# EAGLE schematic InterfazSpectrum (EAGLE 7.1.0)
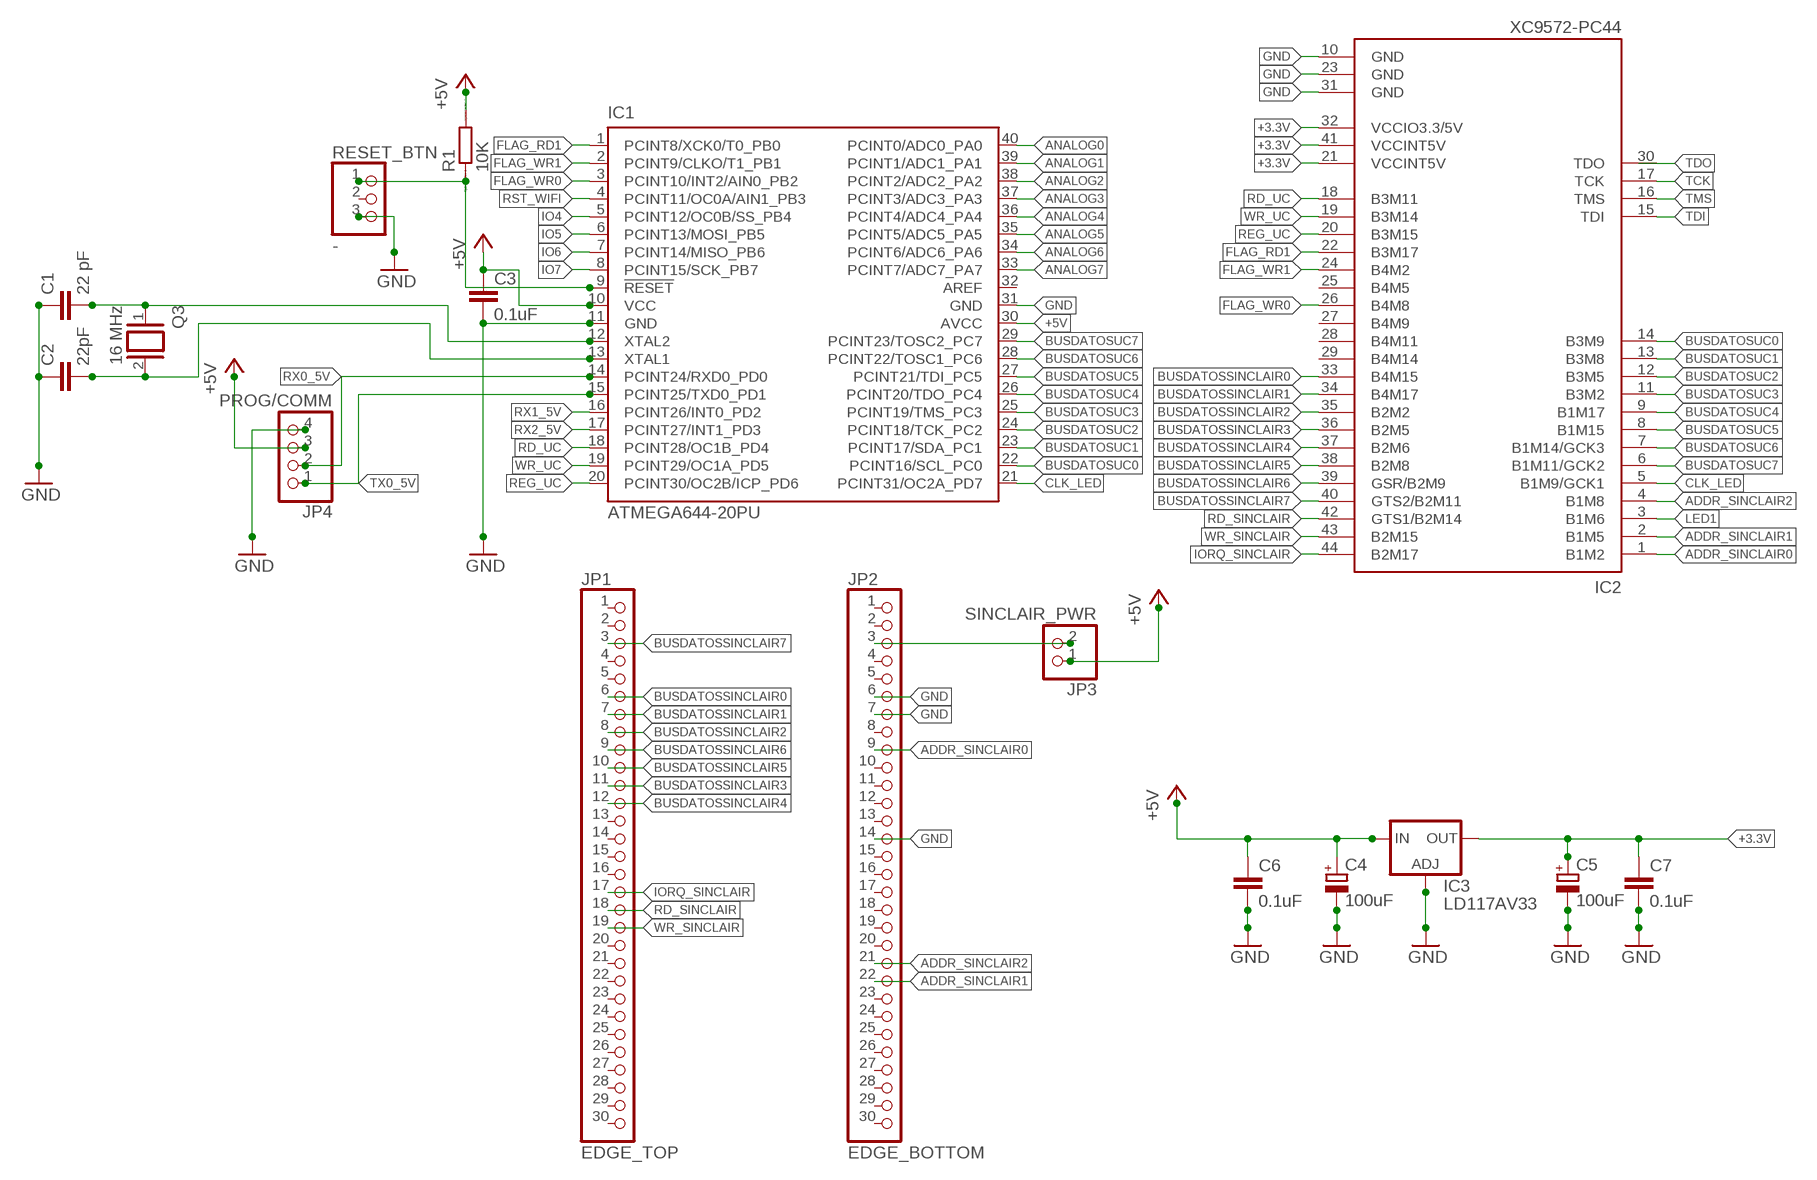
[diagram p0: schematic, sheet 1]

## Parts
C1  22 pF  C-EU025-024X044  [C025-024X044]
C2  22pF  C-EU025-024X044  [C025-024X044]
C3  0.1uF  C-EU025-025X050  [C025-025X050]
C4  100uF  CPOL-EUE2.5-7  [E2,5-7]
C5  100uF  CPOL-EUE2.5-7  [E2,5-7]
C6  0.1uF  C-EU025-025X050  [C025-025X050]
C7  0.1uF  C-EU025-025X050  [C025-025X050]
IC1  ATMEGA644-20PU  [DIL40]
IC2  XC9572-PC44  [PLCC-S44]
IC3  LD117AV33  [TO220L1]
JP1  EDGE_TOP  PINHD-1X30  [1X30]
JP2  EDGE_BOTTOM  PINHD-1X30  [1X30]
JP3  SINCLAIR_PWR  PINHD-1X2  [1X02]
JP4  PROG/COMM  PINHD-1X4  [1X04]
Q3  16 MHz  XTAL/S  [QS]
R1  10K  R-EU_0204_2V  [0204V]
RESET_BTN  -  PINHD-1X3  [1X03]

## Nets
+3.3V: C5.+ C7.1 IC2.21(VCCINT5V) IC2.32(VCCIO3.3/5V) IC2.41(VCCINT5V) IC3.2(OUT)
+5V: C3.1 C4.+ C6.1 IC1.10(VCC) IC1.30(AVCC) IC3.3(IN) JP3.1 JP4.3 R1.2
ADDR_SINCLAIR0: IC2.1(B1M2) JP2.9
ADDR_SINCLAIR1: IC2.2(B1M5) JP2.22
ADDR_SINCLAIR2: IC2.4(B1M8) JP2.21
ANALOG0: IC1.40(PCINT0/ADC0_PA0)
ANALOG1: IC1.39(PCINT1/ADC1_PA1)
ANALOG2: IC1.38(PCINT2/ADC2_PA2)
ANALOG3: IC1.37(PCINT3/ADC3_PA3)
ANALOG4: IC1.36(PCINT4/ADC4_PA4)
ANALOG5: IC1.35(PCINT5/ADC5_PA5)
ANALOG6: IC1.34(PCINT6/ADC6_PA6)
ANALOG7: IC1.33(PCINT7/ADC7_PA7)
BUSDATOSSINCLAIR0: IC2.33(B4M15) JP1.6
BUSDATOSSINCLAIR1: IC2.34(B4M17) JP1.7
BUSDATOSSINCLAIR2: IC2.35(B2M2) JP1.8
BUSDATOSSINCLAIR3: IC2.36(B2M5) JP1.11
BUSDATOSSINCLAIR4: IC2.37(B2M6) JP1.12
BUSDATOSSINCLAIR5: IC2.38(B2M8) JP1.10
BUSDATOSSINCLAIR6: IC2.39(GSR/B2M9) JP1.9
BUSDATOSSINCLAIR7: IC2.40(GTS2/B2M11) JP1.3
BUSDATOSUC0: IC1.22(PCINT16/SCL_PC0) IC2.14(B3M9)
BUSDATOSUC1: IC1.23(PCINT17/SDA_PC1) IC2.13(B3M8)
BUSDATOSUC2: IC1.24(PCINT18/TCK_PC2) IC2.12(B3M5)
BUSDATOSUC3: IC1.25(PCINT19/TMS_PC3) IC2.11(B3M2)
BUSDATOSUC4: IC1.26(PCINT20/TDO_PC4) IC2.9(B1M17)
BUSDATOSUC5: IC1.27(PCINT21/TDI_PC5) IC2.8(B1M15)
BUSDATOSUC6: IC1.28(PCINT22/TOSC1_PC6) IC2.7(B1M14/GCK3)
BUSDATOSUC7: IC1.29(PCINT23/TOSC2_PC7) IC2.6(B1M11/GCK2)
CLK_LED: IC1.21(PCINT31/OC2A_PD7) IC2.5(B1M9/GCK1)
FLAG_RD1: IC1.1(PCINT8/XCK0/T0_PB0) IC2.22(B3M17)
FLAG_WR0: IC1.3(PCINT10/INT2/AIN0_PB2) IC2.26(B4M8)
FLAG_WR1: IC1.2(PCINT9/CLKO/T1_PB1) IC2.24(B4M2)
GND: C1.1 C2.1 C3.2 C4.- C5.- C6.2 C7.2 IC1.11(GND) IC1.31(GND) IC2.10(GND) IC2.23(GND) IC2.31(GND) IC3.1(ADJ) JP2.6 JP2.7 JP2.14 JP4.4 RESET_BTN.3
IO4: IC1.5(PCINT12/OC0B/SS_PB4)
IO5: IC1.6(PCINT13/MOSI_PB5)
IO6: IC1.7(PCINT14/MISO_PB6)
IO7: IC1.8(PCINT15/SCK_PB7)
IORQ_SINCLAIR: IC2.44(B2M17) JP1.17
LED1: IC2.3(B1M6)
N$1: JP2.3 JP3.2
OSC1: C1.2 IC1.12(XTAL2) Q3.1
OSC2: C2.2 IC1.13(XTAL1) Q3.2
RD_SINCLAIR: IC2.42(GTS1/B2M14) JP1.18
RD_UC: IC1.18(PCINT28/OC1B_PD4) IC2.18(B3M11)
REG_UC: IC1.20(PCINT30/OC2B/ICP_PD6) IC2.20(B3M15)
RESET_UC: IC1.9(!RESET) R1.1 RESET_BTN.1
RST_WIFI: IC1.4(PCINT11/OC0A/AIN1_PB3)
RX0_5V: IC1.14(PCINT24/RXD0_PD0) JP4.2
RX1_5V: IC1.16(PCINT26/INT0_PD2)
RX2_5V: IC1.17(PCINT27/INT1_PD3)
TCK: IC2.17(TCK)
TDI: IC2.15(TDI)
TMS: IC2.16(TMS)
TX0_5V: IC1.15(PCINT25/TXD0_PD1) JP4.1
WR_SINCLAIR: IC2.43(B2M15) JP1.19
WR_UC: IC1.19(PCINT29/OC1A_PD5) IC2.19(B3M14)
Unconnected: IC1.32(AREF) IC2.25(B4M5) IC2.27(B4M9) IC2.28(B4M11) IC2.29(B4M14) IC2.30(TDO) JP1.1 JP1.2 JP1.4 JP1.5 JP1.13 JP1.14 JP1.15 JP1.16 JP1.20 JP1.21 JP1.22 JP1.23 JP1.24 JP1.25 JP1.26 JP1.27 JP1.28 JP1.29 JP1.30 JP2.1 JP2.2 JP2.4 JP2.5 JP2.8 JP2.10 JP2.11 JP2.12 JP2.13 JP2.15 JP2.16 JP2.17 JP2.18 JP2.19 JP2.20 JP2.23 JP2.24 JP2.25 JP2.26 JP2.27 JP2.28 JP2.29 JP2.30 RESET_BTN.2

## Library data of the parts
C1-C3 C6 C7 = rcl:C-EU: CAPACITOR, European symbol
C4 C5 = rcl:CPOL-EU: POLARIZED CAPACITOR, European symbol
IC1 = atmel:ATMEGA644-*PU: 8-bit Microcontroller with 64K Bytes In-System Programmable Flash Auto generated by make-symbol-device-package-bsdl.ulp Rev. 34 Source: http://www.atmel.com/dyn/resources/prod_documents/doc2593.pdf; MPN: ATMEGA644-20PU; OC_FARNELL: 1288340; OC_NEWARK: 23M5060
IC2 = eOscope:XC9572-PC44
IC3 = v-reg:LD117A?*: Low drop fixed and adjustable positive voltage regulators 1 A Source: http://www.st.com/stonline/products/literature/ds/7194/ld1117axx.pdf
JP1 JP2 = pinhead:PINHD-1X30: PIN HEADER
JP3 = pinhead:PINHD-1X2: PIN HEADER
JP4 = pinhead:PINHD-1X4: PIN HEADER
Q3 = special:XTAL/S: CRYSTAL
R1 = resistor:R-EU_: RESISTOR, European symbol; SPICEPREFIX: R
RESET_BTN = pinhead:PINHD-1X3: PIN HEADER

## Net classes
0 default: width 0.001 mm